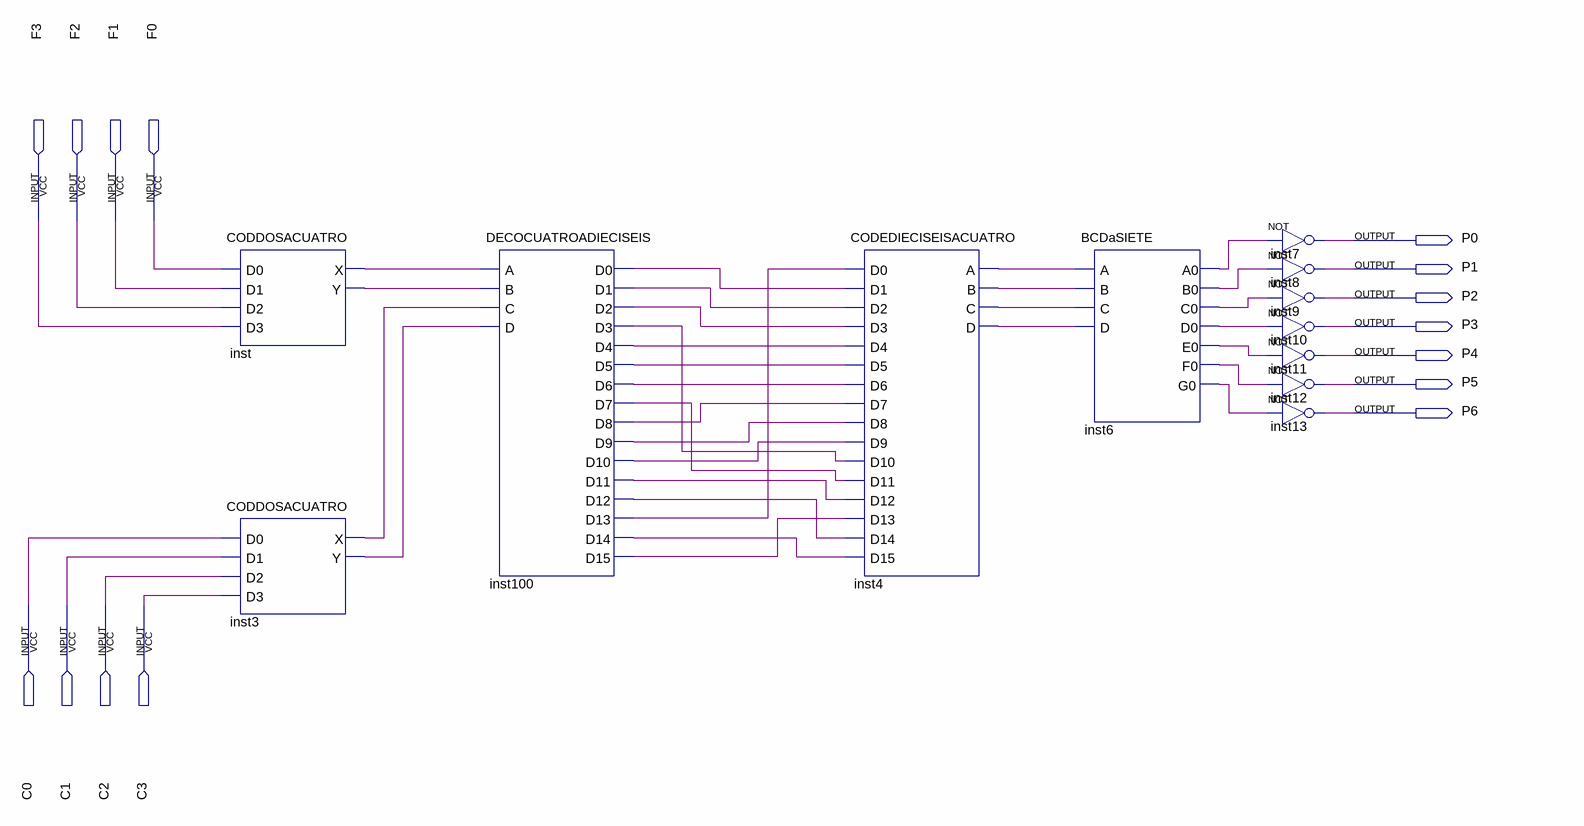
[diagram p0: schematic sheet]
// Quartus schematic COMPRIMIDO.bdf as structural Verilog: 12 symbols, 15 pins
module COMPRIMIDO (
  input  F3,
  input  F2,
  input  F1,
  input  F0,
  input  C0,
  input  C1,
  input  C2,
  input  C3,
  output P0,
  output P1,
  output P2,
  output P3,
  output P4,
  output P5,
  output P6
);

  wire inst3_x, inst3_y, inst4_a, inst4_b, inst4_c, inst4_d, inst6_a0, inst6_b0, inst6_c0, inst6_d0,
       inst6_e0, inst6_f0, inst6_g0, inst100_d0, inst100_d1, inst100_d2, inst100_d3, inst100_d4, inst100_d5,
       inst100_d6, inst100_d7, inst100_d8, inst100_d9, inst100_d10, inst100_d11, inst100_d12, inst100_d13,
       inst100_d14, inst100_d15, inst_x, inst_y;

  CODDOSACUATRO inst (.D0(F0), .D1(F1), .D2(F2), .D3(F3), .X(inst_x), .Y(inst_y));
  CODDOSACUATRO inst3 (.D0(C0), .D1(C1), .D2(C2), .D3(C3), .X(inst3_x), .Y(inst3_y));
  DECOCUATROADIECISEIS inst100 (
    .A(inst_x), .B(inst_y), .C(inst3_x), .D(inst3_y), .D0(inst100_d0), .D1(inst100_d1), .D2(inst100_d2),
    .D3(inst100_d3), .D4(inst100_d4), .D5(inst100_d5), .D6(inst100_d6), .D7(inst100_d7), .D8(inst100_d8),
    .D9(inst100_d9), .D10(inst100_d10), .D11(inst100_d11), .D12(inst100_d12), .D13(inst100_d13),
    .D14(inst100_d14), .D15(inst100_d15));
  CODEDIECISEISACUATRO inst4 (
    .D0(inst100_d13), .D1(inst100_d0), .D2(inst100_d1), .D3(inst100_d2), .D4(inst100_d4), .D5(inst100_d5),
    .D6(inst100_d6), .D7(inst100_d8), .D8(inst100_d9), .D9(inst100_d10), .D10(inst100_d3), .D11(inst100_d7),
    .D12(inst100_d11), .D13(inst100_d15), .D14(inst100_d12), .D15(inst100_d14), .A(inst4_a), .B(inst4_b),
    .C(inst4_c), .D(inst4_d));
  BCDaSIETE inst6 (
    .A(inst4_a), .B(inst4_b), .C(inst4_c), .D(inst4_d), .A0(inst6_a0), .B0(inst6_b0), .C0(inst6_c0),
    .D0(inst6_d0), .E0(inst6_e0), .F0(inst6_f0), .G0(inst6_g0));
  not inst7 (P0, inst6_a0);
  not inst8 (P1, inst6_b0);
  not inst9 (P2, inst6_c0);
  not inst10 (P3, inst6_d0);
  not inst11 (P4, inst6_e0);
  not inst12 (P5, inst6_f0);
  not inst13 (P6, inst6_g0);
endmodule
